# EAGLE design cpld (EAGLE 7.7.0)
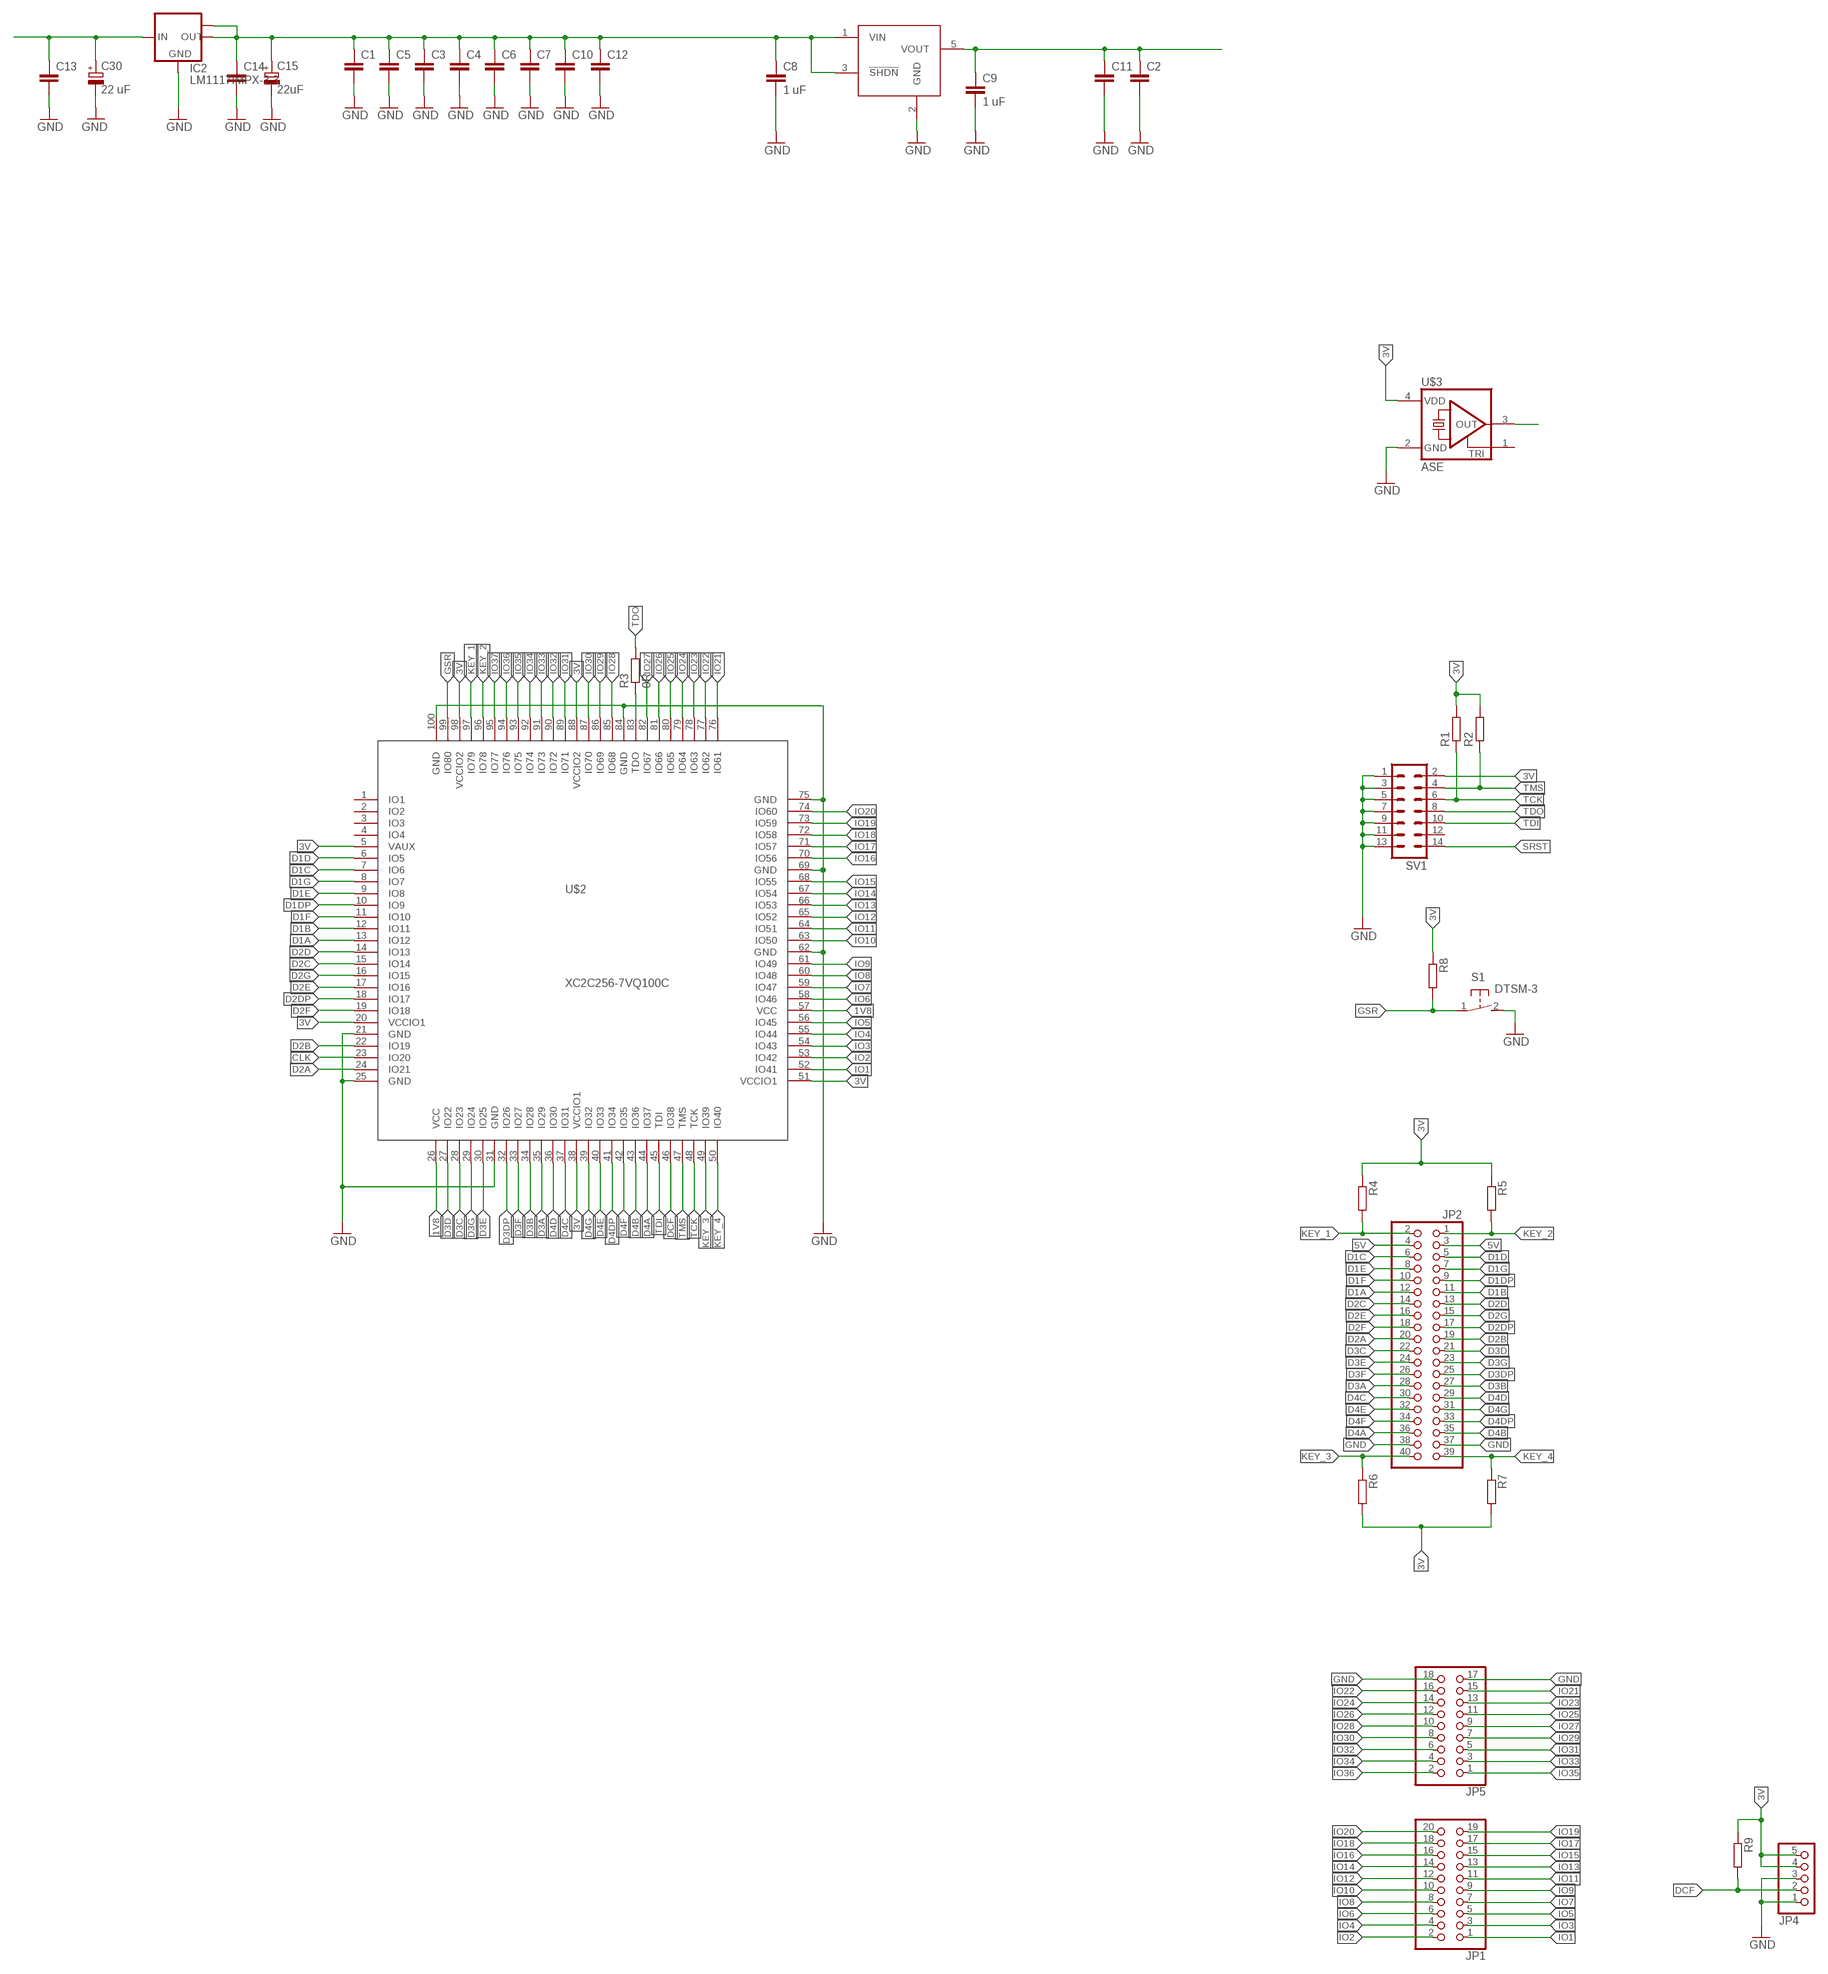
[diagram p0: schematic, sheet 1]

## Parts
C1  C-EUC0603  [C0603]
C2  C-EUC0603  [C0603]
C3  C-EUC0402  [C0402]
C4  C-EUC0603  [C0603]
C5  C-EUC0603  [C0603]
C6  C-EUC0402  [C0402]
C7  C-EUC0603  [C0603]
C8  1 uF  C-EUC0603  [C0603]
C9  1 uF  C-EUC0603  [C0603]
C10  C-EUC0603  [C0603]
C11  C-EUC0603  [C0603]
C12  C-EUC0603  [C0603]
C13  C-EUC0603  [C0603]
C14  C-EUC0603  [C0603]
C15  22uF  CPOL-EUSMCA  [SMC_A]
C30  22 uF  CPOL-EUSMCA  [SMC_A]
IC2  LM1117IMPX-3.3  [SOT223]
JP1  PINHD-2X10  [2X10]
JP2  PINHD-2X20_2.54-SMD  [2X20SMD]
JP4  PINHD-1X5  [1X05]
JP5  PINHD-2X9  [2X09]
R1  R-EU_R0402  [R0402]
R2  R-EU_R0402  [R0402]
R3  0R  R-EU_R1206  [R1206]
R4  R-EU_R0402  [R0402]
R5  R-EU_R0603  [R0603]
R6  R-EU_R0603  [R0603]
R7  R-EU_R0603  [R0603]
R8  R-EU_R0603  [R0603]
R9  R-EU_R0603  [R0603]
S1  DTSM-3  [DTSM-3]
SV1  ML14  [ML14]
U$1  MCP1802  [SOT23-5]
U$2  XC2C256-7VQ100C  [TQFP100]
U$3  ASE  [ASE]

## Nets
1V8: C2.1 C9.1 C11.1 U$1.5(VOUT) U$2.26(VCC) U$2.57(VCC)
3V: C1.1 C3.1 C4.1 C5.1 C6.1 C7.1 C8.1 C10.1 C12.1 C14.1 C15.+ IC2.2(OUT) IC2.TAB(OUT1) JP4.4 JP4.5 R1.2 R2.2 R4.1 R5.1 R6.2 R7.2 R8.1 R9.1 SV1.2 U$1.1(VIN) U$1.3(!SHDN) U$2.5(VAUX) U$2.20(VCCIO1) U$2.38(VCCIO1) U$2.51(VCCIO1) U$2.88(VCCIO2) U$2.98(VCCIO2) U$3.4(VDD)
5V: C13.1 C30.+ IC2.3(IN) JP2.3 JP2.4
CLK: U$2.23(IO20) U$3.3(OUT)
D1A: JP2.12 U$2.13(IO12)
D1B: JP2.11 U$2.12(IO11)
D1C: JP2.6 U$2.7(IO6)
D1D: JP2.5 U$2.6(IO5)
D1DP: JP2.9 U$2.10(IO9)
D1E: JP2.8 U$2.9(IO8)
D1F: JP2.10 U$2.11(IO10)
D1G: JP2.7 U$2.8(IO7)
D2A: JP2.20 U$2.24(IO21)
D2B: JP2.19 U$2.22(IO19)
D2C: JP2.14 U$2.15(IO14)
D2D: JP2.13 U$2.14(IO13)
D2DP: JP2.17 U$2.18(IO17)
D2E: JP2.16 U$2.17(IO16)
D2F: JP2.18 U$2.19(IO18)
D2G: JP2.15 U$2.16(IO15)
D3A: JP2.28 U$2.35(IO29)
D3B: JP2.27 U$2.34(IO28)
D3C: JP2.22 U$2.28(IO23)
D3D: JP2.21 U$2.27(IO22)
D3DP: JP2.25 U$2.32(IO26)
D3E: JP2.24 U$2.30(IO25)
D3F: JP2.26 U$2.33(IO27)
D3G: JP2.23 U$2.29(IO24)
D4A: JP2.36 U$2.44(IO37)
D4B: JP2.35 U$2.43(IO36)
D4C: JP2.30 U$2.37(IO31)
D4D: JP2.29 U$2.36(IO30)
D4DP: JP2.33 U$2.41(IO34)
D4E: JP2.32 U$2.40(IO33)
D4F: JP2.34 U$2.42(IO35)
D4G: JP2.31 U$2.39(IO32)
DCF: JP4.2 R9.2 U$2.46(IO38)
GND: C1.2 C2.2 C3.2 C4.2 C5.2 C6.2 C7.2 C8.2 C9.2 C10.2 C11.2 C12.2 C13.2 C14.2 C15.- C30.- IC2.1(GND) JP2.37 JP2.38 JP4.1 JP4.3 JP5.17 JP5.18 S1.2 SV1.1 SV1.3 SV1.5 SV1.7 SV1.9 SV1.11 SV1.13 U$1.2(GND) U$2.21(GND) U$2.25(GND) U$2.31(GND) U$2.62(GND) U$2.69(GND) U$2.75(GND) U$2.84(GND) U$2.100(GND) U$3.2(GND)
GSR: R8.2 S1.1 U$2.99(IO80)
IO1: JP1.1 U$2.52(IO41)
IO2: JP1.2 U$2.53(IO42)
IO3: JP1.3 U$2.54(IO43)
IO4: JP1.4 U$2.55(IO44)
IO5: JP1.5 U$2.56(IO45)
IO6: JP1.6 U$2.58(IO46)
IO7: JP1.7 U$2.59(IO47)
IO8: JP1.8 U$2.60(IO48)
IO9: JP1.9 U$2.61(IO49)
IO10: JP1.10 U$2.63(IO50)
IO11: JP1.11 U$2.64(IO51)
IO12: JP1.12 U$2.65(IO52)
IO13: JP1.13 U$2.66(IO53)
IO14: JP1.14 U$2.67(IO54)
IO15: JP1.15 U$2.68(IO55)
IO16: JP1.16 U$2.70(IO56)
IO17: JP1.17 U$2.71(IO57)
IO18: JP1.18 U$2.72(IO58)
IO19: JP1.19 U$2.73(IO59)
IO20: JP1.20 U$2.74(IO60)
IO21: JP5.15 U$2.76(IO61)
IO22: JP5.16 U$2.77(IO62)
IO23: JP5.13 U$2.78(IO63)
IO24: JP5.14 U$2.79(IO64)
IO25: JP5.11 U$2.80(IO65)
IO26: JP5.12 U$2.81(IO66)
IO27: JP5.9 U$2.82(IO67)
IO28: JP5.10 U$2.85(IO68)
IO29: JP5.7 U$2.86(IO69)
IO30: JP5.8 U$2.87(IO70)
IO31: JP5.5 U$2.89(IO71)
IO32: JP5.6 U$2.90(IO72)
IO33: JP5.3 U$2.91(IO73)
IO34: JP5.4 U$2.92(IO74)
IO35: JP5.1 U$2.93(IO75)
IO36: JP5.2 U$2.94(IO76)
IO37: U$2.95(IO77)
KEY_1: JP2.2 R4.2 U$2.97(IO79)
KEY_2: JP2.1 R5.2 U$2.96(IO78)
KEY_3: JP2.40 R6.1 U$2.49(IO39)
KEY_4: JP2.39 R7.1 U$2.50(IO40)
N$1: R3.1 U$2.83(TDO)
SRST: SV1.14
TCK: R1.1 SV1.6 U$2.48(TCK)
TDI: SV1.10 U$2.45(TDI)
TDO: R3.2 SV1.8
TMS: R2.1 SV1.4 U$2.47(TMS)
Unconnected: SV1.12 U$2.1(IO1) U$2.2(IO2) U$2.3(IO3) U$2.4(IO4) U$3.1(TRI)

## Library data of the parts
C1-C14 = rcl:C-EU: CAPACITOR, European symbol
C15 C30 = rcl:CPOL-EU: POLARIZED CAPACITOR, European symbol
IC2 = lm1117:LM1117IMPX-*
JP1 = pinhead:PINHD-2X10: PIN HEADER
JP2 = pinhead-2:PINHD-2X20: PIN HEADER
JP4 = pinhead:PINHD-1X5: PIN HEADER
JP5 = pinhead:PINHD-2X9: PIN HEADER
R1-R9 = rcl:R-EU_: RESISTOR, European symbol
S1 = switch-tact:DTSM-3
SV1 = con-harting-ml:ML14: HARTING; OC_FARNELL: unknown; OC_NEWARK: unknown
U$1 = adam - ics:MCP1802: MCP1802: 300mA, low dropout (250mV) Vout: fixed values from 0.9V to 6.0V Vin: Vout + .25V to 10V digikey: MCP1802T-5002I/OTCT-ND, 5V, SOT-23-5, $1.53
U$2 = mw:XC2C256-7VQ100C
U$3 = crystal:ASE: 3.3Vdc CMOS SMD CRYSTAL CLOCK OSCILLATOR SOurce: www.abracon.com; OC_FARNELL: unknown; OC_NEWARK: unknown

## Board
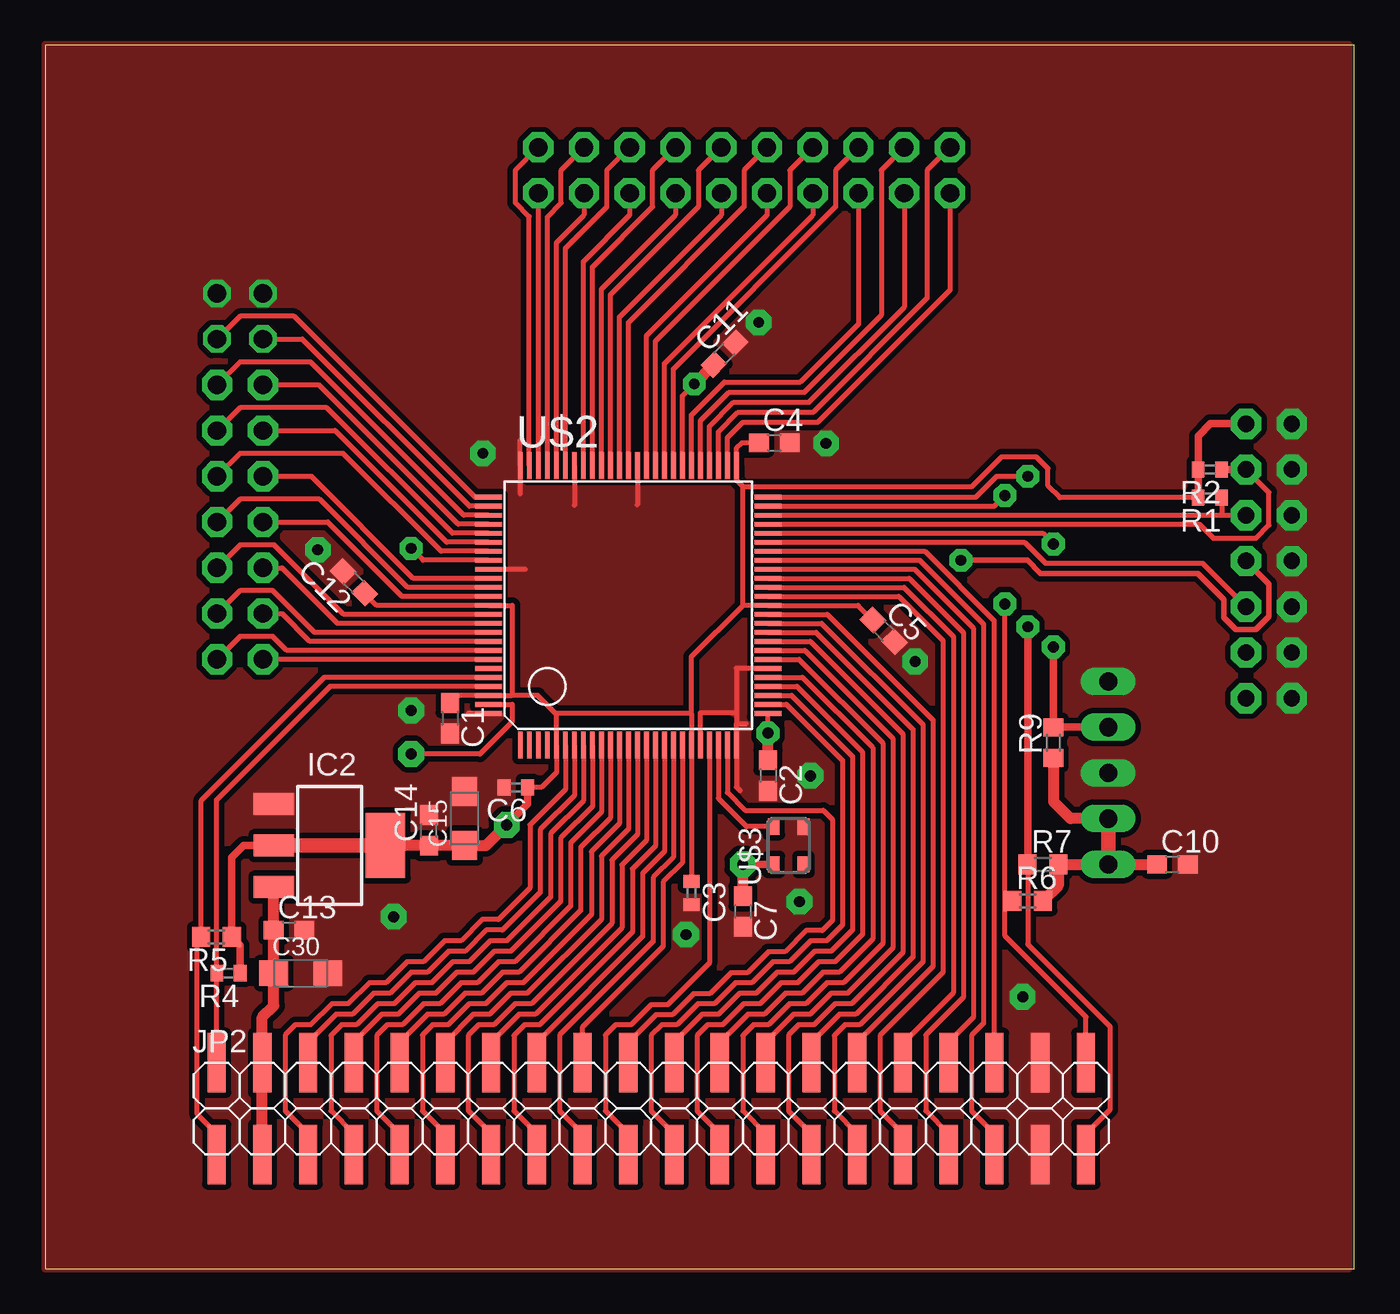
[diagram p1: board, top side]
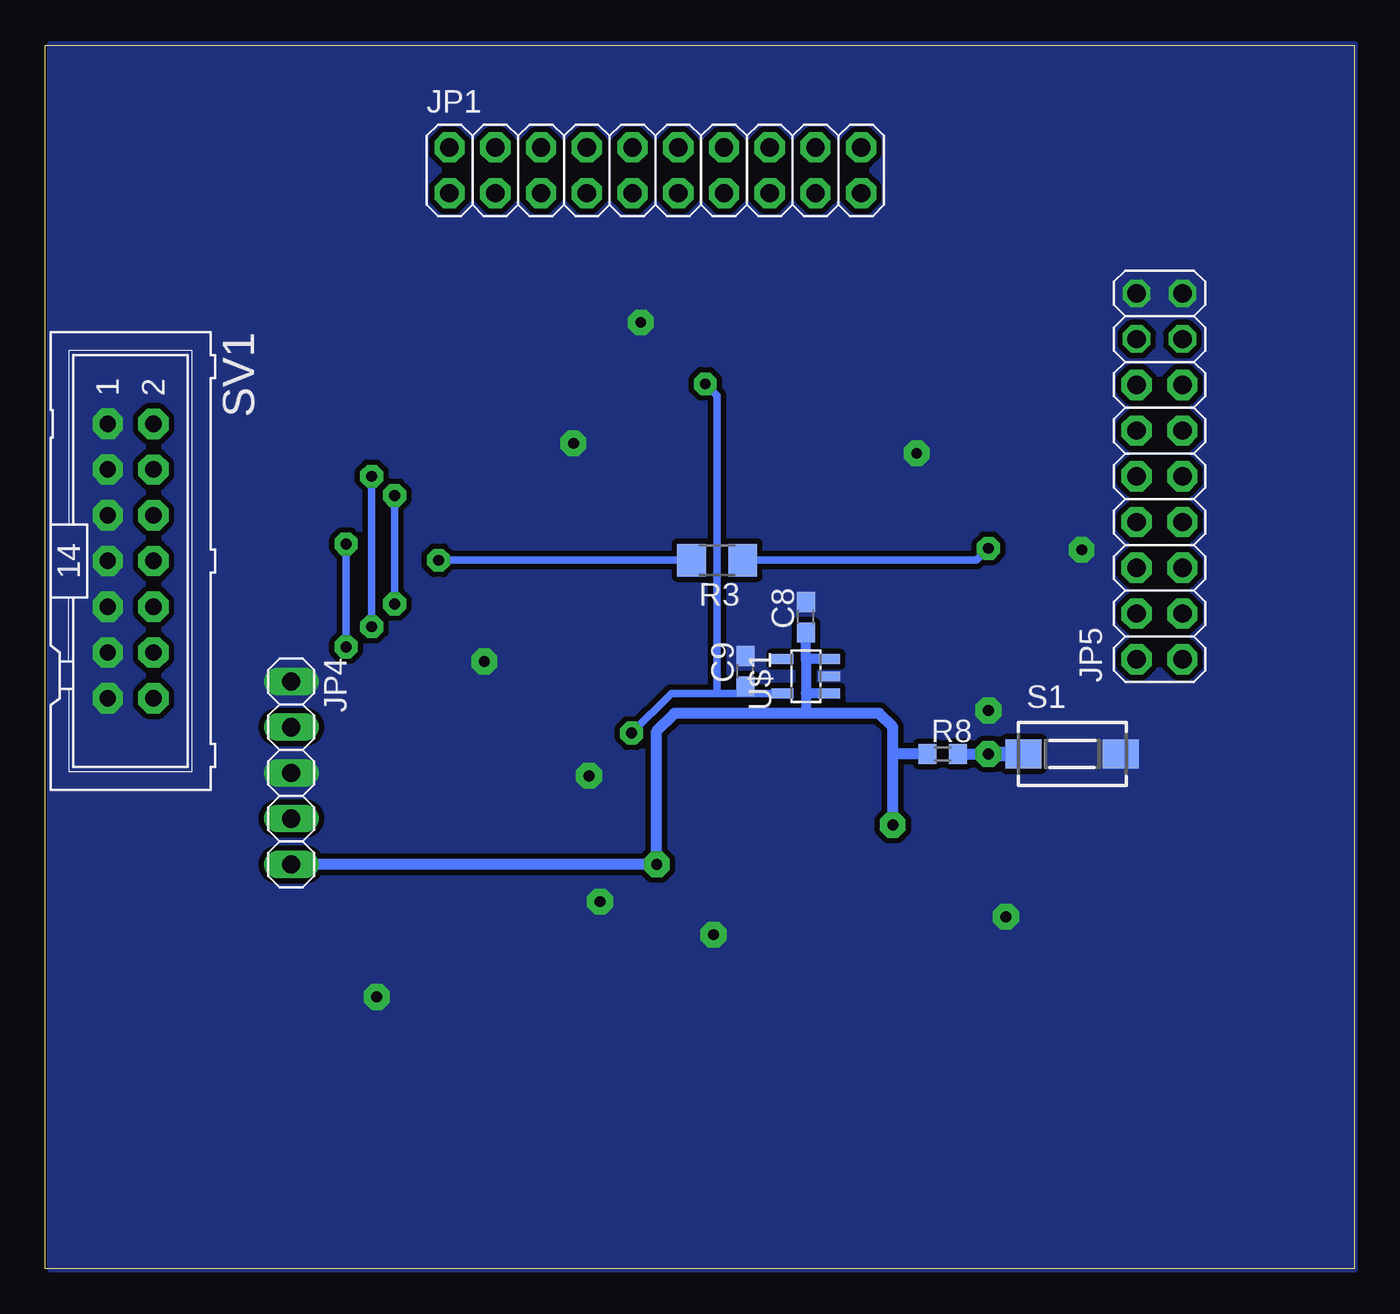
[diagram p2: board, bottom side, seen from below]

Size 72.69 x 67.94 mm. Coordinates in mm from the lower left corner, seen from the top.
Outline: 0,0 72.69,0 72.69,67.94 0,67.94 0,0
Copper layers (1*16): Top 0.035mm / dielectric 1.5mm / Bottom 0.035mm
Design rules "default *": minimum track width 10mil, minimum drill 24mil, track to track 8mil, track to pad 8mil, pad to pad 8mil, via to via 8mil, smd to smd 8mil, copper to edge 0mil, drill to drill 8mil, minimum pad ring 10mil, minimum via ring 8mil, stop-mask expansion 4mil, vias tented up to drill 0mil, thermal gap 10mil
tRestrict: area 26.2,28.3 to 38,30.4; area 26.7,43.8 to 38,45.4; area 39.3,30.7 to 40.9,36.8; area 23.9,31.5 to 25.4,43

### Footprints (pad centres in the part's own frame; a part is rotated, then mirrored left to right if it is on the bottom)
C0603 = smd 1.1 x 1: 1 -0.85,0; 2 0.85,0
C0402 = smd 0.7 x 0.9: 1 -0.65,0; 2 0.65,0
SMC_A = smd 1.6 x 1.4: + -1.5,0; - 1.5,0
SOT223 = smd 1.219 x 2.235: 1 -2.311,-3.099; 2 0,-3.099; 3 2.311,-3.099 | smd 3.6 x 2.2: TAB 0,3.099
2X10 = drill 1.016 pad 1.676 octagon: 1 -11.43,-1.27; 2 -11.43,1.27; 3 -8.89,-1.27; 4 -8.89,1.27; 5 -6.35,-1.27; 6 -6.35,1.27; 7 -3.81,-1.27; 8 -3.81,1.27; 9 -1.27,-1.27; 10 -1.27,1.27; 11 1.27,-1.27; 12 1.27,1.27; 13 3.81,-1.27; 14 3.81,1.27; 15 6.35,-1.27; 16 6.35,1.27; 17 8.89,-1.27; 18 8.89,1.27; 19 11.43,-1.27; 20 11.43,1.27
2X20SMD = smd 1.016 x 3.302: 1 -1.27,-3.81; 2 -1.27,1.27; 3 1.27,-3.81; 4 1.27,1.27; 5 3.81,-3.81; 6 3.81,1.27; 7 6.35,-3.81; 8 6.35,1.27; 9 8.89,-3.81; 10 8.89,1.27; 11 11.43,-3.81; 12 11.43,1.27; 13 13.97,-3.81; 14 13.97,1.27; 15 16.51,-3.81; 16 16.51,1.27; 17 19.05,-3.81; 18 19.05,1.27; 19 21.59,-3.81; 20 21.59,1.27; 21 24.13,-3.81; 22 24.13,1.27; 23 26.67,-3.81; 24 26.67,1.27; 25 29.21,-3.81; 26 29.21,1.27; 27 31.75,-3.81; 28 31.75,1.27; 29 34.29,-3.81; 30 34.29,1.27; 31 36.83,-3.81; 32 36.83,1.27; 33 39.37,-3.81; 34 39.37,1.27; 35 41.91,-3.81; 36 41.91,1.27; 37 44.45,-3.81; 38 44.45,1.27; 39 46.99,-3.81; 40 46.99,1.27
1X05 = drill 1.016 long: 1 -5.08,0; 2 -2.54,0; 3 0,0; 4 2.54,0; 5 5.08,0
2X09 = drill 1.016 pad 1.676 octagon: 1 -10.16,-1.27; 2 -10.16,1.27; 3 -7.62,-1.27; 4 -7.62,1.27; 5 -5.08,-1.27; 6 -5.08,1.27; 7 -2.54,-1.27; 8 -2.54,1.27; 9 0,-1.27; 10 0,1.27; 11 2.54,-1.27; 12 2.54,1.27; 13 5.08,-1.27; 14 5.08,1.27 | drill 1.016 octagon: 15 7.62,-1.27; 16 7.62,1.27; 17 10.16,-1.27; 18 10.16,1.27
R0402 = smd 0.7 x 0.9: 1 -0.65,0; 2 0.65,0
R1206 = smd 1.6 x 1.803: 1 -1.422,0; 2 1.422,0
R0603 = smd 1 x 1.1: 1 -0.85,0; 2 0.85,0
DTSM-3 = smd 2 x 1.6: 1 -2.7,0; 2 2.7,0
ML14 = drill 0.914 pad 1.676 octagon: 1 -7.62,-1.27; 2 -7.62,1.27; 3 -5.08,-1.27; 4 -5.08,1.27; 5 -2.54,-1.27; 6 -2.54,1.27; 7 0,-1.27; 8 0,1.27; 9 2.54,-1.27; 10 2.54,1.27; 11 5.08,-1.27; 12 5.08,1.27; 13 7.62,-1.27; 14 7.62,1.27
SOT23-5 = smd 0.55 x 1.2: 1 -0.95,-1.3; 2 0,-1.3; 3 0.95,-1.3; 4 0.95,1.3; 5 -0.95,1.3
TQFP100 = smd 0.27 x 1.5: 1 -6,-7.75; 2 -5.5,-7.75; 3 -5,-7.75; 4 -4.5,-7.75; 5 -4,-7.75; 6 -3.5,-7.75; 7 -3,-7.75; 8 -2.5,-7.75; 9 -2,-7.75; 10 -1.5,-7.75; 11 -1,-7.75; 12 -0.5,-7.75; 13 0,-7.75; 14 0.5,-7.75; 15 1,-7.75; 16 1.5,-7.75; 17 2,-7.75; 18 2.5,-7.75; 19 3,-7.75; 20 3.5,-7.75; 21 4,-7.75; 22 4.5,-7.75; 23 5,-7.75; 24 5.5,-7.75; 25 6,-7.75; 51 6,7.75; 52 5.5,7.75; 53 5,7.75; 54 4.5,7.75; 55 4,7.75; 56 3.5,7.75; 57 3,7.75; 58 2.5,7.75; 59 2,7.75; 60 1.5,7.75; 61 1,7.75; 62 0.5,7.75; 63 0,7.75; 64 -0.5,7.75; 65 -1,7.75; 66 -1.5,7.75; 67 -2,7.75; 68 -2.5,7.75; 69 -3,7.75; 70 -3.5,7.75; 71 -4,7.75; 72 -4.5,7.75; 73 -5,7.75; 74 -5.5,7.75; 75 -6,7.75 | smd 1.5 x 0.27: 26 7.75,-6; 27 7.75,-5.5; 28 7.75,-5; 29 7.75,-4.5; 30 7.75,-4; 31 7.75,-3.5; 32 7.75,-3; 33 7.75,-2.5; 34 7.75,-2; 35 7.75,-1.5; 36 7.75,-1; 37 7.75,-0.5; 38 7.75,0; 39 7.75,0.5; 40 7.75,1; 41 7.75,1.5; 42 7.75,2; 43 7.75,2.5; 44 7.75,3; 45 7.75,3.5; 46 7.75,4; 47 7.75,4.5; 48 7.75,5; 49 7.75,5.5; 50 7.75,6; 76 -7.75,6; 77 -7.75,5.5; 78 -7.75,5; 79 -7.75,4.5; 80 -7.75,4; 81 -7.75,3.5; 82 -7.75,3; 83 -7.75,2.5; 84 -7.75,2; 85 -7.75,1.5; 86 -7.75,1; 87 -7.75,0.5; 88 -7.75,0; 89 -7.75,-0.5; 90 -7.75,-1; 91 -7.75,-1.5; 92 -7.75,-2; 93 -7.75,-2.5; 94 -7.75,-3; 95 -7.75,-3.5; 96 -7.75,-4; 97 -7.75,-4.5; 98 -7.75,-5; 99 -7.75,-5.5; 100 -7.75,-6
ASE = smd 0.9 x 0.65: 1 -1.05,-0.825; 2 1.05,-0.825; 3 1.05,0.825; 4 -1.05,0.825

### Placement (x,y rotation side)
C1  22.48,30.56 270 top
C2  40.13,27.38 270 top
C3  35.88,20.85 270 top
C4  40.49,45.85 0 top
C5  46.56,35.41 315 top
C6  26.14,26.72 180 top
C7  38.73,19.84 270 top
C8  30.45,36.17 90 bottom
C9  33.81,33.17 90 bottom
C10  62.59,22.45 0 top
C11  37.72,50.8 45 top
C12  17.14,38.1 135 top
C13  13.55,18.8 0 top
C14  21.31,24.33 90 top
C15  23.29,24.99 90 top
C30  14.2,16.41 0 top
IC2  15.8,23.5 270 top
JP1  38.81,60.99 0 bottom
JP2  10.79,10.16 0 top
JP4  59.03,27.52 270 bottom
JP5  10.82,43.99 90 bottom
R1  64.67,42.81 180 top
R2  64.67,44.37 180 top
R3  35.38,39.33 180 bottom
R4  10.19,16.41 180 top
R5  9.53,18.41 180 top
R6  54.56,20.42 0 top
R7  55.4,22.45 0 top
R8  22.86,28.57 0 bottom
R9  55.98,29.21 90 top
S1  15.67,28.57 0 bottom
SV1  67.94,39.29 270 bottom
U$1  30.45,32.89 90 bottom
U$2  32.38,36.83 0 top
U$3  41.27,23.5 90 top

### Tracks (layer width: path | path; a pad name or v marks a point on that pad's centre or on a via)
1V8  (via drill 0.6 pad 1.27)
  Top 0.267: v40.13,29.74 U$2.26 | U$2.57 35.38,48.47 v36.04,49.12
  Top 0.61: C2.1 v40.13,29.73 v40.13,29.74 | v36.04,49.12 C11.1
  Bottom 0.406: 35.38,31.95 35.38,48.47 v36.04,49.12 | U$1.5 33.66,31.94 | 33.66,31.94 35.38,31.94 35.38,31.95 | 35.38,31.95 37.92,31.95 v40.13,29.74 | C9.1 33.81,32.09 33.66,31.94
3V  (via drill 0.6 pad 1.42)
  Top 0.267: C1.1 22.9,31.83 U$2.98 25.93,31.83 | 35.88,30.83 U$2.20 C3.1 | 35.88,30.83 28.35,30.83 | 38.73,36.83 U$2.38 45.14,36.83 C5.1 | 25.93,31.83 25.93,36.83 U$2.88 18.41,36.83 C12.1 | 38.73,36.83 38.73,43.43 | 28.35,30.83 28.39,30.79 U$2.5 28.39,27.55 27.56,26.72 C6.1 | 38.73,43.43 38.38,43.78 U$2.51 38.38,45.55 38.69,45.85 C4.1 | 38.73,43.43 51.46,43.43 53.11,45.09 55.02,45.09 55.68,44.42 55.68,43.46 56.33,42.81 R1.2 | 35.88,30.83 35.88,33.98 38.73,36.83 | 28.35,30.83 27.35,31.83 25.93,31.83
  Top 0.406: R1.2 R2.2 64.02,46.24 64.69,46.91 SV1.2 | C14.1 21.58,23.48 21.59,23.5 | C15.+ 22.86,23.49 22.86,23.5 | C6.1 26.79,25.8 v25.63,24.64 | U$3.4 v38.73,22.45 | R4.1 10.84,17.95 R5.1 10.38,22.85 11.02,23.5 IC2.2
  Top 0.61: 22.86,23.5 21.59,23.5 IC2.TAB | C15.+ 24.48,23.49 v25.63,24.64 | R6.2 56.25,21.26 R7.2 JP4.5 C10.1 | C7.1 v38.73,22.45 | R9.1 55.98,25.93 56.93,24.98 JP4.4
  Top 0.813: IC2.2 IC2.TAB | JP4.5 JP4.4
  Bottom 0.549: U$1.3 30.45,33.84 | 30.45,33.84 30.45,31.94 | U$1.1 30.45,31.94 | 30.45,31.94 30.45,30.83 | 30.45,33.84 C8.1
  Bottom 0.61: v25.63,24.64 25.63,28.57 | 25.63,28.57 25.63,30.07 26.39,30.83 30.45,30.83 37.75,30.83 38.73,29.84 v38.73,22.45 JP4.5 | R8.1 25.63,28.57
5V
  Top 0.61: JP2.3 JP2.4 12.06,13.97 12.7,14.61 C30.+ C13.1 IC2.3
CLK
  Top 0.267: U$3.3 38.95,24.55 37.38,26.11 U$2.23
D1A
  Top 0.267: U$2.13 32.38,24.41 30.89,22.91 30.89,19.41 26.77,15.29 25.86,15.29 24.69,14.12 23.77,14.12 22.23,12.57 JP2.12
D1B
  Top 0.267: U$2.12 31.89,24.72 30.33,23.16 30.33,19.66 26.54,15.88 25.63,15.88 24.46,14.71 23.55,14.71 22.38,13.54 21.51,13.54 20.95,12.98 20.95,8.76 22.23,7.49 JP2.11
D1C
  Top 0.267: U$2.7 29.39,26.29 27.48,24.38 27.48,20.88 25.4,18.8 24.49,18.8 23.32,17.63 22.4,17.63 21.23,16.46 20.32,16.46 19.15,15.29 18.24,15.29 17.07,14.12 16.15,14.12 14.61,12.57 JP2.6
D1D
  Top 0.267: U$2.6 28.89,26.6 26.92,24.64 26.92,21.13 25.17,19.38 24.26,19.38 23.09,18.21 22.17,18.21 21.01,17.04 20.09,17.04 18.92,15.88 18.01,15.88 16.84,14.71 15.93,14.71 14.76,13.54 13.89,13.54 13.34,12.98 13.34,8.76 14.61,7.49 JP2.5
D1DP
  Top 0.267: U$2.10 30.89,25.35 29.18,23.65 29.18,20.14 26.09,17.04 25.17,17.04 24,15.88 23.09,15.88 21.92,14.71 21.01,14.71 19.84,13.54 19,13.54 18.41,12.95 18.41,8.76 19.68,7.49 JP2.9
D1E
  Top 0.267: U$2.9 30.39,25.66 28.63,23.9 28.63,20.4 25.86,17.63 24.94,17.63 23.77,16.46 22.86,16.46 21.69,15.29 20.78,15.29 19.61,14.12 18.69,14.12 17.14,12.57 JP2.8
D1F
  Top 0.267: U$2.11 31.39,25.04 29.74,23.39 29.74,19.89 26.31,16.46 25.4,16.46 24.23,15.29 23.32,15.29 22.15,14.12 21.23,14.12 19.68,12.57 JP2.10
D1G
  Top 0.267: U$2.8 29.89,25.97 28.07,24.16 28.07,20.65 25.63,18.21 24.71,18.21 23.55,17.04 22.63,17.04 21.46,15.88 20.55,15.88 19.38,14.71 18.47,14.71 17.3,13.54 16.46,13.54 15.88,12.95 15.88,8.76 17.14,7.49 JP2.7
D2A
  Top 0.267: JP2.20 32.38,12.57 33.91,14.1 34.82,14.1 35.99,15.27 36.91,15.27 38.08,16.43 38.99,16.43 40.16,17.6 41.07,17.6 42.24,18.77 43.16,18.77 43.71,19.33 43.71,24.94 43.2,25.45 38.86,25.45 37.88,26.43 U$2.24
D2B
  Top 0.267: JP2.19 32.38,7.49 31.11,8.76 31.11,12.98 31.67,13.54 32.54,13.54 33.66,14.66 34.57,14.66 36.88,16.97 U$2.22
D2C
  Top 0.267: U$2.15 33.38,23.78 32.03,22.43 32.03,18.92 27.23,14.12 26.31,14.12 24.77,12.57 JP2.14
D2D
  Top 0.267: U$2.14 32.88,24.1 31.47,22.68 31.47,19.18 27,14.71 26.09,14.71 24.92,13.54 24.08,13.54 23.5,12.95 23.5,8.79 24.77,7.52 JP2.13
D2DP
  Top 0.267: U$2.18 34.88,22.84 33.76,21.72 33.76,18.16 28.57,12.98 28.57,8.76 29.84,7.49 JP2.17
D2E
  Top 0.267: U$2.17 34.38,23.16 33.17,21.95 33.17,18.44 27.3,12.57 JP2.16
D2F
  Top 0.267: U$2.19 35.38,22.53 34.31,21.46 34.31,17.91 29.84,13.44 JP2.18
D2G
  Top 0.267: U$2.16 33.88,23.47 32.61,22.2 32.61,18.69 27.46,13.54 26.62,13.54 26.04,12.95 26.04,8.76 27.3,7.49 JP2.15
D3A
  Top 0.267: U$2.35 42.8,35.33 48.18,29.95 48.18,17.3 45.01,14.12 44.09,14.12 42.55,12.57 JP2.28
D3B
  Top 0.267: U$2.34 42.49,34.83 47.62,29.69 47.62,17.55 44.78,14.71 43.87,14.71 42.7,13.54 41.83,13.54 41.27,12.98 41.27,8.76 42.55,7.49 JP2.27
D3C
  Top 0.267: U$2.28 41.45,31.83 44.83,28.45 44.83,18.82 43.64,17.63 42.72,17.63 41.55,16.46 40.64,16.46 39.47,15.29 38.56,15.29 37.39,14.12 36.47,14.12 34.92,12.57 JP2.22
D3D
  Top 0.267: U$2.27 41.16,31.33 44.27,28.22 44.27,19.1 43.38,18.21 42.49,18.21 41.33,17.04 40.41,17.04 39.24,15.88 38.33,15.88 37.16,14.71 36.25,14.71 35.08,13.54 34.24,13.54 33.66,12.95 33.66,8.76 34.92,7.49 JP2.21
D3DP
  Top 0.267: U$2.32 41.86,33.83 46.51,29.18 46.51,18.06 44.32,15.88 43.41,15.88 42.24,14.71 41.33,14.71 40.16,13.54 39.32,13.54 38.73,12.95 38.73,8.76 40.01,7.49 JP2.25
D3E
  Top 0.267: U$2.30 42.05,32.83 45.95,28.93 45.95,18.31 44.09,16.46 43.18,16.46 42.01,15.29 41.1,15.29 39.93,14.12 39.01,14.12 37.47,12.57 JP2.24
D3F
  Top 0.267: U$2.33 42.17,34.33 45.64,30.86 45.87,30.63 47.07,29.44 47.07,17.8 44.55,15.29 43.64,15.29 42.47,14.12 41.55,14.12 40.01,12.57 JP2.26
D3G
  Top 0.267: U$2.29 41.74,32.33 45.39,28.68 45.39,18.57 43.87,17.04 42.95,17.04 41.78,15.88 40.87,15.88 39.7,14.71 38.79,14.71 37.62,13.54 36.78,13.54 36.2,12.95 36.2,8.76 37.47,7.49 JP2.23
D4A
  Top 0.267: U$2.44 48.84,39.83 52.7,35.97 JP2.36
D4B
  Top 0.267: U$2.43 48.55,39.33 52.09,35.79 52.09,13.61 51.44,12.95 51.44,8.76 52.7,7.49 JP2.35
D4C
  Top 0.267: U$2.37 43.43,36.33 49.3,30.45 49.3,16.79 45.09,12.57 JP2.30
D4D
  Top 0.267: U$2.36 43.11,35.83 48.74,30.2 48.74,17.04 45.24,13.54 44.4,13.54 43.81,12.95 43.81,8.76 45.09,7.49 JP2.29
D4DP
  Top 0.267: U$2.41 47.98,38.33 50.98,35.33 50.98,15.06 48.9,12.98 48.9,8.76 50.16,7.49 JP2.33
D4E
  Top 0.267: U$2.40 47.69,37.83 50.42,35.1 50.42,15.32 47.62,12.52 JP2.32
D4F
  Top 0.267: U$2.42 48.27,38.83 51.54,35.56 51.54,13.95 50.16,12.57 JP2.34
D4G
  Top 0.267: U$2.39 47.4,37.33 49.86,34.87 49.86,16.46 46.35,12.95 46.35,8.76 47.62,7.49 JP2.31
DCF  (via drill 0.6 pad 1.27)
  Top 0.267: U$2.46 55.38,40.83 v55.98,40.23
  Top 0.406: v55.98,34.52 R9.2 JP4.2
  Bottom 0.406: v55.98,34.52 v55.98,40.23
GND  (via drill 0.6 pad 1.42)
  Top 0.267: U$2.100 23.49,30.83 | U$2.84 26.66,38.83 | 26.39,46.01 U$2.75 26.39,43.03 | U$2.69 29.39,42.37 | U$2.62 32.88,42.41 | 38.38,30.26 U$2.25 38.38,26.74 38.58,26.54 | 38.38,30.26 38.94,30.26 | 38.38,30.86 36.38,30.86 U$2.21 | U$2.31 38.38,33.33 38.38,30.86 | 38.38,30.86 38.38,30.26
  other vias: 42.49,27.36 48.31,33.71 35.59,18.55 19.35,19.54 43.36,45.83 20.32,30.99 54.28,15.09 24.31,45.27 39.62,52.53 15.14,39.91 41.88,20.38
  pour Top (isolate 0.305, no thermals): 0,67.94 0,0 72.39,0 72.39,67.94
  pour Bottom (isolate 0.305, no thermals): 0,67.94 0,0 72.39,0 72.39,67.94
GSR  (via drill 0.6 pad 1.42)
  Top 0.267: U$2.99 25.93,31.33 25.93,30.35 24.15,28.57 v20.32,28.57
  Bottom 0.61: R8.2 v20.32,28.57
  Bottom 0.813: v20.32,28.57 S1.1
IO1
  Top 0.267: U$2.52 37.88,46.14 38.73,46.99 42.9,46.99 50.24,54.33 JP1.1
IO2
  Top 0.267: U$2.53 37.38,46.45 38.48,47.55 42.65,47.55 48.97,53.87 48.97,60.98 JP1.2
IO3
  Top 0.267: U$2.54 36.88,46.77 38.23,48.11 42.42,48.11 47.7,53.39 JP1.3
IO4
  Top 0.267: U$2.55 36.38,47.08 37.97,48.67 42.16,48.67 46.43,52.93 46.43,60.98 JP1.4
IO5
  Top 0.267: U$2.56 35.88,47.39 37.72,49.23 41.94,49.23 45.16,52.45 JP1.5
IO6
  Top 0.267: U$2.58 34.88,49.95 43.89,58.95 43.89,60.98 JP1.6
IO7
  Top 0.267: U$2.59 34.38,50.26 42.62,58.5 JP1.7
IO8
  Top 0.267: U$2.60 33.88,51.49 41.35,58.95 41.35,60.98 JP1.8
IO9
  Top 0.267: U$2.61 33.38,51.8 40.08,58.5 JP1.9
IO10
  Top 0.267: U$2.63 32.38,52.53 38.81,58.95 38.81,60.98 JP1.10
IO11
  Top 0.267: U$2.64 31.89,52.84 37.54,58.5 JP1.11
IO12
  Top 0.267: U$2.65 31.39,54.07 36.27,58.95 36.27,60.98 JP1.12
IO13
  Top 0.267: U$2.66 30.89,54.38 35,58.5 JP1.13
IO14
  Top 0.267: U$2.67 30.39,55.61 33.73,58.95 33.73,60.98 JP1.14
IO15
  Top 0.267: U$2.68 29.89,55.92 32.46,58.5 JP1.15
IO16
  Top 0.267: U$2.70 28.89,56.65 31.19,58.95 31.19,60.98 JP1.16
IO17
  Top 0.267: U$2.71 28.39,56.96 29.92,58.5 JP1.17
IO18
  Top 0.267: U$2.72 27.89,58.39 28.65,59.16 28.65,60.98 JP1.18
IO19
  Top 0.267: U$2.73 JP1.19
IO20
  Top 0.267: U$2.74 26.89,58.41 26.11,59.18 26.11,60.98 JP1.20
IO21
  Top 0.267: U$2.76 23.87,42.83 13.82,52.88 10.82,52.88 JP5.15
IO22
  Top 0.267: U$2.77 23.56,42.33 14.28,51.61 JP5.16
IO23
  Top 0.267: U$2.78 23.25,41.83 14.73,50.34 10.82,50.34 JP5.13
IO24
  Top 0.267: U$2.79 22.93,41.33 15.19,49.07 JP5.14
IO25
  Top 0.267: U$2.80 22.62,40.83 15.65,47.8 10.82,47.8 JP5.11
IO26
  Top 0.267: U$2.81 22.31,40.33 16.1,46.53 JP5.12
IO27
  Top 0.267: U$2.82 21.99,39.83 16.56,45.26 10.82,45.26 JP5.9
IO28
  Top 0.267: U$2.85 20.45,38.33 14.78,43.99 JP5.10
IO29
  Top 0.267: U$2.86 20.13,37.83 15.24,42.72 10.82,42.72 JP5.7
IO30
  Top 0.267: U$2.87 19.82,37.33 15.7,41.45 JP5.8
IO31
  Top 0.267: U$2.89 16.58,36.33 12.72,40.18 10.82,40.18 JP5.5
IO32
  Top 0.267: U$2.90 16.24,35.83 13.16,38.91 JP5.6
IO33
  Top 0.267: U$2.91 14.96,35.33 12.65,37.64 10.82,37.64 JP5.3
IO34
  Top 0.267: U$2.92 14.7,34.83 13.16,36.37 JP5.4
IO35
  Top 0.267: U$2.93 13.42,34.33 12.65,35.1 10.82,35.1 JP5.1
IO36
  Top 0.267: U$2.94 JP5.2
KEY_1
  Top 0.267: JP2.2 9.53,16.51 | 9.53,16.51 9.53,26.04 15.82,32.33 U$2.97 | R4.2 9.54,16.5 9.53,16.51
KEY_2
  Top 0.267: JP2.1 9.53,7.49 8.46,8.56 8.46,18.2 R5.2 8.68,26 15.51,32.83 U$2.96
KEY_3  (via drill 0.6 pad 1.27)
  Top 0.267: JP2.40 57.78,13.97 53.29,18.47 53.29,20.32 | U$2.49 52.69,42.33 v53.29,42.93 | 53.29,20.32 v53.29,36.91 | R6.1 53.39,20.42 53.29,20.32
  Bottom 0.406: v53.29,36.91 v53.29,42.93
KEY_4  (via drill 0.6 pad 1.27)
  Top 0.267: JP2.39 57.78,7.49 59.13,8.84 59.13,13.44 54.56,18.01 54.56,22.23 54.55,22.24 R7.1 | U$2.50 51.67,42.83 52.83,43.99 v54.56,43.99
  Top 0.406: v54.56,35.64 54.56,22.23
  Bottom 0.406: v54.56,43.99 v54.56,35.64
N$1  (via drill 0.6 pad 1.27)
  Top 0.267: U$2.83 20.98,39.33 v20.32,39.99
  Bottom 0.406: R3.1 20.98,39.33 v20.32,39.99
TCK
  Top 0.267: U$2.48 65.41,41.83 | 65.41,41.83 SV1.6 | R1.1 65.32,41.92 65.41,41.83
TDI
  Top 0.267: U$2.45 54.36,40.33 55.52,39.17 64.26,39.17 SV1.10
TDO  (via drill 0.6 pad 1.27)
  Top 0.305: SV1.8 67.94,38.02 67.94,36.2 67.23,35.48 66.12,35.48 65.44,36.16 65.44,37.15 64.01,38.58 55.27,38.58 54.52,39.33 v50.85,39.33
  Bottom 0.406: R3.2 v50.85,39.33
TMS
  Top 0.267: U$2.47 64.08,41.33 64.85,40.56 67.23,40.56 67.94,41.27 67.94,43.1 SV1.4
  Top 0.406: R2.1 SV1.4